# Altium schematic sheet MainArduino.SchDoc
size A4; SheetNumber: 2; SheetTotal: 2
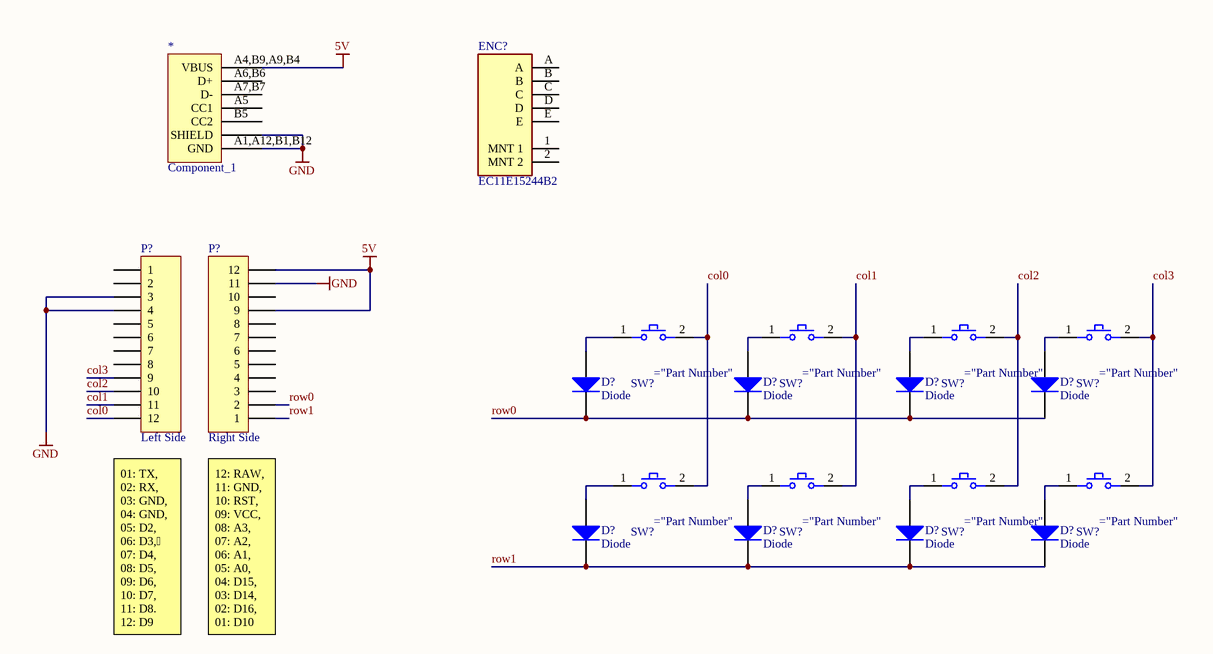
[diagram p0: MainArduino.SchDoc]

## Parts
(Parts that share a designator on the sheet are numbered #1, #2 ... from top to bottom, then left to right.)
*  Component_1
D?#1  Diode  [SMC]
D?#2  Diode  [SMC]
D?#3  Diode  [SMC]
D?#4  Diode  [SMC]
D?#5  Diode  [SMC]
D?#6  Diode  [SMC]
D?#7  Diode  [SMC]
D?#8  Diode  [SMC]
ENC?  Part Number: EC11E15244B2  [ALPS_EC11E15244B2_0]  (hidden comment: Enc_ALPS_EC11E15244B2_eec)
P?#1  Left Side  [HDR1X12]
P?#2  Right Side  [HDR1X12]
SW?#1  MX1A-C1NW  (value not drawn)
SW?#2  MX1A-C1NW  (value not drawn)
SW?#3  MX1A-C1NW  (value not drawn)
SW?#4  MX1A-C1NW  (value not drawn)
SW?#5  MX1A-C1NW  (value not drawn)
SW?#6  MX1A-C1NW  (value not drawn)
SW?#7  MX1A-C1NW  (value not drawn)
SW?#8  MX1A-C1NW  (value not drawn)

## Nets
5V: *.A4,B9,A9,B4(VBUS) P?#2.9 P?#2.12
GND: *.?1(SHIELD) *.A1,A12,B1,B12(GND) P?#1.3 P?#1.4 P?#2.11
col0: P?#1.12 SW?#1.2 SW?#5.2
col1: P?#1.11 SW?#2.2 SW?#6.2
col2: P?#1.10 SW?#3.2 SW?#7.2
col3: P?#1.9 SW?#4.2 SW?#8.2
row0: D?#1.2(K) D?#2.2(K) D?#3.2(K) D?#4.2(K) P?#2.2
row1: D?#5.2(K) D?#6.2(K) D?#7.2(K) D?#8.2(K) P?#2.1
NetD?#1_1: D?#1.1(A) SW?#1.1
NetD?#2_1: D?#2.1(A) SW?#2.1
NetD?#3_1: D?#3.1(A) SW?#3.1
NetD?#4_1: D?#4.1(A) SW?#4.1
NetD?#5_1: D?#5.1(A) SW?#5.1
NetD?#6_1: D?#6.1(A) SW?#6.1
NetD?#7_1: D?#7.1(A) SW?#7.1
NetD?#8_1: D?#8.1(A) SW?#8.1

Not connected (* = marked no-connect by the designer): * A5(CC1) A6,B6(D+) A7,B7(D-) B5(CC2); ENC? 1(MNT_1) 2(MNT_2) A B C D E; P?#1 1 2 5 6 7 8; P?#2 3 4 5 6 7 8 10

## Notes on the sheet
- (near P?#1) 01: TX, 02: RX, 03: GND, 04: GND, 05: D2, 06: D3, 07: D4, 08: D5, 09: D6, 10: D7, 11: D8. 12: D9
- (near P?#2) 12: RAW, 11: GND, 10: RST, 09: VCC, 08: A3, 07: A2, 06: A1, 05: A0, 04: D15, 03: D14, 02: D16, 01: D10

## Library data of the parts
D?#1-D?#8 = Diode: Default Diode; Published: 8-Jun-2000; LatestRevisionDate: 17-Jul-2002; LatestRevisionNote: Re-released for DXP Platform.; PackageVersion: Sep-1996; PackageReference: SMC; Publisher: Altium Limited; PackageDescription: DO-214-AB/SMC; 2 C-Bend Leads; Body 7.9 x 5.9 mm, inc. leads (LxW); Code_JEDEC: DO-214-AB
ENC? = Enc_ALPS_EC11E15244B2_eec: Manufacturer: ALPS; Ratings: 10mA 5V DC; Actuator length: 20mm; Number of pulse: 15; Operating life: 15,000 cycles; Number of detent: 30; helpURL: https://upverter.com/upn/revision/bf96b8ba6cbf8ed0/; ComponentLink2Description: Datasheet; Temperature: -40°C to +85°C; Package: PTH_ENC_11MM7_12MM0; Supplier 2: Mouser; Supplier 1: Digi-Key; ComponentLink1URL: https://upverter.com/upn/revision/bf96b8ba6cbf8ed0/; Supplier Part Number 2: 688-EC11E15244B2; ComponentLink1Description: Upverter; ComponentLink2URL: http://www.alps.com/prod/info/E/HTML/Encoder/Incremental/EC11/EC11E15244B2.html; RoHS: TRUE; Mouser Part Number: 688-EC11E15244B2; Temperature Range High: +85°C; Temperature Range Low: -40°C; Lead Free: yes
P?#1 P?#2 = Header 12: Header, 12-Pin; LatestRevisionDate: 17-Jul-2002; LatestRevisionNote: Re-released for DXP Platform.; Publisher: Altium Limited